# Altium schematic sheet Power supply.SchDoc
size A4; SheetNumber: 6; SheetTotal: 7
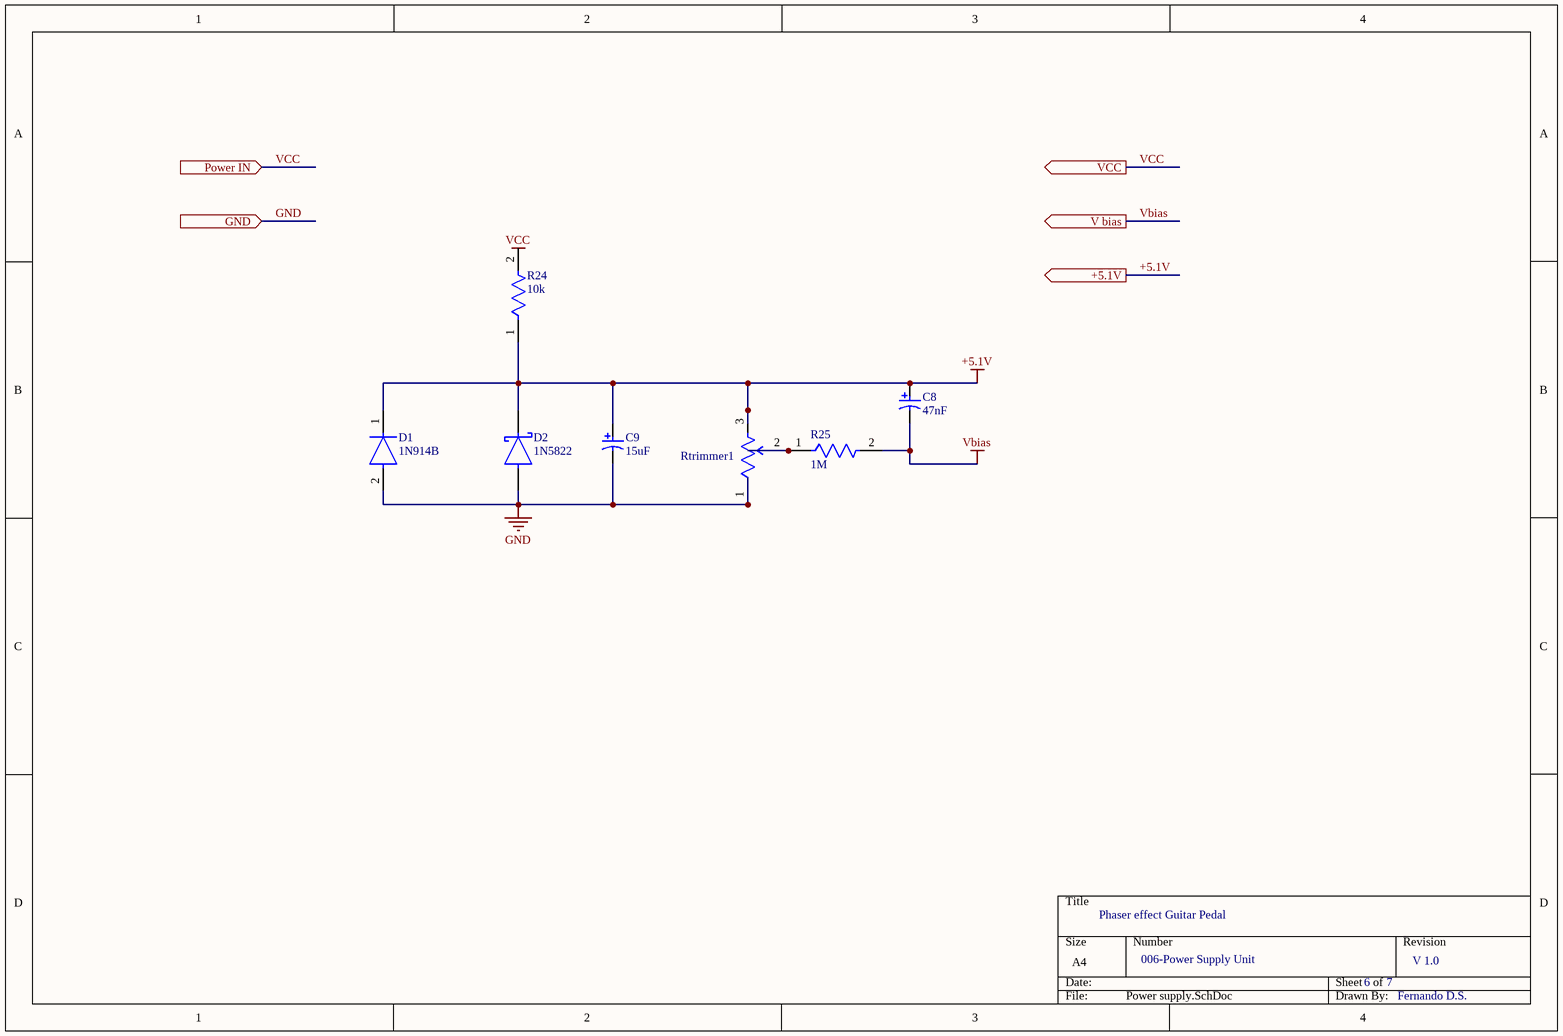
[diagram p0: Power supply.SchDoc]

## Parts
C8  47nF  [NIC-PLF-10x13-2_V]
C9  15uF  [NIC-PLF-10x13-2_V]
D1  1N914B  [FP-017AG-MFG]
D2  1N5822  [FP-DO-201AD-MFG]
R24  10k  [FP-MRS25-MFG]
R25  1M  [FP-MRS25-MFG]
Rtrimmer1  3362P-1-252LF  [FP-3362P-MFG]  (value not drawn)

## Ports
+5.1V (out, see Main[2A], Input Buffer[1A], LFO[1A], Output Mixer[1A], Phase Shifting Stage[1A]), GND (in, see Main[1A]), Power IN (in, see Main[1A]), V bias (out, see Main[2A], LFO[1A]), VCC (out, see Main[2A], Input Buffer[1A], LFO[1A], Phase Shifting Stage[1A], Selection[1A])

## Nets
+5.1V: C8.1 C9.1 D1.1(C) D2.1(C) R24.1 Rtrimmer1.3(CW) ; port +5.1V
GND: C9.2 D1.2(A) D2.2(A) Rtrimmer1.1(CCW) ; port GND
Vbias: C8.2 R25.2 ; port V bias
VCC: port Power IN, port VCC
NetR25_1: R25.1 Rtrimmer1.2(WIPER)

Not connected (* = marked no-connect by the designer): R24 2

## Notes on the sheet
- Phaser effect Guitar Pedal
- 006-Power Supply Unit
- 6
- 7
- V 1.0
- Fernando D.S.
- Labels drawn without touching a wire or pin: VCC

## Library data of the parts
C8 C9 = CMP-1234-00001-1: Aluminum Electrolytic Capacitor, 470 uF +/-20%, 10 V, -55 to 105 degC, 2-Pin THD, RoHS; Manufacturer: Nichicon; PartNumber: PLF1A471MDO1; Leakage Current: 0.94 mA; Rated Ripple: 5700 mA; Rated Voltage: 10 V; Rated Capacitance: 470 uF; ComponentLink3URL: http://nichicon-us.com/english/products/pdfs/e-lf.pdf; PackageDescription: 2-Pin Through Hole Device, Dia 10 mm, Body Length 13 mm, Pin Spacing 5 mm; ComponentLink2URL: http://nichicon-us.com/english/products/pdfs/e-lf.pdf; RoHS: TRUE; ComponentLink1URL: http://www.nichicon.co.jp/; ComponentLink2Description: Datasheet; Capacitance Tolerance: +/-20%; ComponentLink1Description: Manufacturer URL; Mounting Technology: Through Hole; ComponentLink3Description: Package Specification; Temperature Range: -55 to 105 degC; DatasheetVersion: Sep-13
D1 = CMP-07163-000001-1: DIODE GEN PURP 100V 200MA DO35; Manufacturer: ON Semiconductor; Forward Current: 300mA; Max Junction Temp: +175°C; Peak Reverse Current: 5uA; Value: 4pF; Max Surge Forward Current: 1A; Device Class L1: Discrete Semiconductors; Manufacturer Part Number: 1N914B; Automotive: No; Temperature: -55°C to +175°C; Temperature Range Low: -55°C; Reverse Voltage: 100V; Category: Diode; Footprint Url: https://www.onsemi.com/pub/Collateral/017AG.PDF; Package: 017AG; Lead Free: Yes; Digikey Description: DIODE GEN PURP 100V 200MA DO35; Height: 1.91mm; Device Class L3: Rectifier Diodes; ComponentLink2URL: https://www.onsemi.com/pub/Collateral/1N914-D.PDF; Octopart: https://octopart.com/1n914b-on+semiconductor-84323163; Capacitance: 4pF; Device Class L2: Diodes; Mouser Description: Diodes - General Purpose, Power, Switching 100V Io/200mA BULK; RoHS: TRUE; Max Repetitive Reverse Voltage: 100V; Temperature Range High: +175°C; ComponentLink2Description: Datasheet
D2 = CMP-12187-000025-1: DIODE SCHOTTKY 40V 3A DO201AD; Manufacturer: STMicroelectronics; Max Junction Temp: +150°C; Peak Reverse Current: 2mA; Max Surge Forward Current: 80A; Temperature Range High: +150°C; Automotive: No; RoHS: TRUE; ComponentLink2Description: Datasheet; Manufacturer Part Number: 1N5822; Lead Free: Yes; Octopart: https://octopart.com/1n5822-stmicroelectronics-323225; Device Class L2: Diodes; Max Repetitive Reverse Voltage: 40V; Temperature: to +150°C; Height: 5.3mm; Category: Diode; Digikey Description: DIODE SCHOTTKY 40V 3A DO201AD; ComponentLink2URL: https://www.st.com/resource/en/datasheet/1n5822.pdf; Device Class L3: Schottky Diodes; Device Class L1: Discrete Semiconductors; Forward Current: 3A; Mouser Description: Schottky Diodes & Rectifiers Vr/40V Io/3A BULK; Package: DO-201AD
R24 R25 = CMP-00030-42757237-1: MRS25000C1000FRP00 Resistor, 100 Ohm, ± 1%, 600 mW, Axial Leaded, Metal Film (Thin Film), Professional; Max Power Dissipation: 600mW; Resistance: 100Ω; Voltage Rating: 350V; Temperature Coefficient: 50ppm/°C; Lead Diameter: 600µm; RoHS: Compliant; Radiation Hardening: No; Schedule B: 8533210090, 8533210090; Length: 6.5mm; Packaging: Tape & Reel (TR); Number of Terminations: 2; Mount: Through Hole; Width: 2.5mm; Tolerance: 1%; Military Standard: Not; Voltage Rating (DC): 350V; Contact Plating: Tin; Number of Pins: 2; Max Operating Temperature: 155°C; NexarPartId: 42757237; Diameter: 2.5mm; Composition: Metal Film, Thin Film; REACH SVHC: Unknown; Power Rating: 600mW; Lead Free: Lead Free; Termination: Axial; Case/Package: Axial; Min Operating Temperature: -55°C
Rtrimmer1 = CMP-00059-10485830-1: 3362P-1-252LF 1/4" Sq, Thru-Hole, TRIMMER, 2.5 Kilohms, Cermet, Single Turn; Temperature Coefficient: 100ppm/°C; Power Rating: 500mW; Tolerance: 10%; Resistance: 2.5kΩ; Number of Turns: 1; Depth: 6.99mm; Min Operating Temperature: -55°C; Radiation Hardening: No; Max Operating Temperature: 125°C; Termination: Pin; NexarPartId: 10485830; Height: 4.699mm; Length: 6.6mm; RoHS: Compliant; Mount: Through Hole; Width: 6.604mm; Schedule B: 8533400080, 8533400080; REACH SVHC: No SVHC; Composition: Cermet; Max Power Dissipation: 500mW; Military Standard: Not